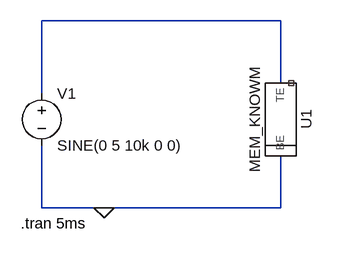
[diagram p0: schematic 滞回特性曲线.asc]
滞回特性曲线.asc, the LTspice schematic file:
Version 4
SHEET 1 880 680
WIRE 368 48 0 48
WIRE 368 144 368 48
WIRE 0 160 0 48
WIRE 0 336 0 240
WIRE 96 336 0 336
WIRE 368 336 368 256
WIRE 368 336 96 336
FLAG 96 336 0
SYMBOL voltage 0 144 R0
WINDOW 123 0 0 Left 0
WINDOW 39 0 0 Left 0
SYMATTR InstName V1
SYMATTR Value SINE(0 5 10k 0 0)
SYMBOL MEM_KNOWM 368 192 R90
SYMATTR InstName U1
TEXT -32 360 Left 2 !.tran 5ms

The netlist it stands for:
* 滞回特性曲线.asc
V1 N001 0 SINE(0 5 10k 0 0)
XU1 N001 0 NC_01 MEM_KNOWM  ; pins TE BE XSV
.tran 5ms
.lib C:\Users\yv236\Documents\LTspice\memristor_knowm.sub
.backanno
.end